# Altium schematic sheet 数控电源.SCHDOC
size 254 x 165 mm; SheetNumber: 0; SheetTotal: 0
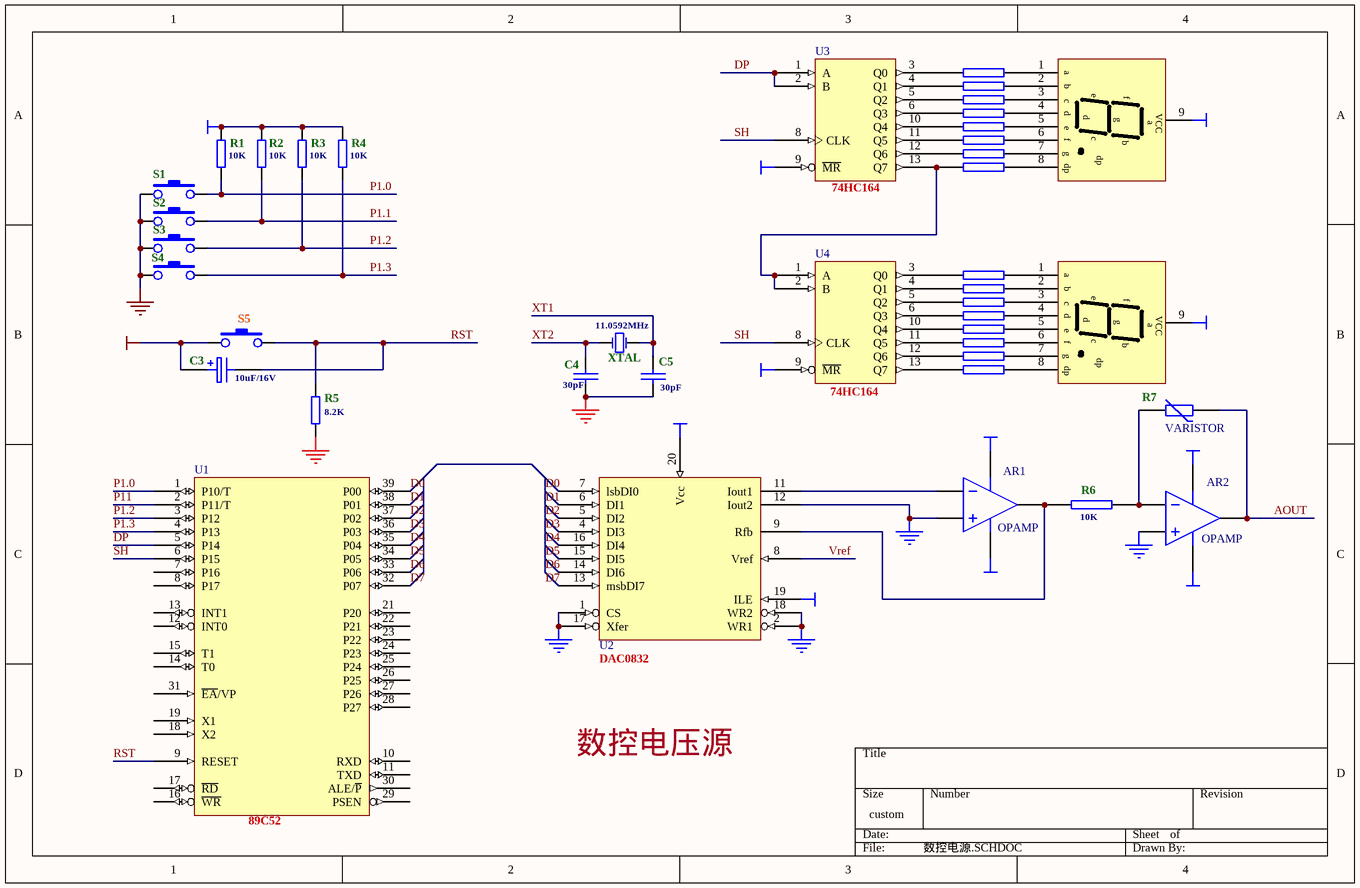
[diagram p0: 数控电源.SCHDOC]

## Parts
(Parts that share a designator on the sheet are numbered #1, #2 ... from top to bottom, then left to right.)
11.0592MHz  XTAL  [BCY-W2/D3.1]
?#1  (no value)
?#2  (no value)
AR1  OPAMP
AR2  OPAMP
C3  10uF/16V  [e100]
C4  30pF  [C0805]
C5  30pF  [C0805]
R1  10K  [r0805]
R2  10K  [r0805]
R3  10K  [r0805]
R4  10K  [r0805]
R5#1  (no value)
R5#2  (no value)
R5#3  8.2K  [r0805]
R6#1  (no value)
R6#2  (no value)
R6#3  10K
R7#1  (no value)
R7#2  (no value)
R7#3  VARISTOR
R8#1  (no value)
R8#2  (no value)
R9#1  (no value)
R9#2  (no value)
R10#1  (no value)
R10#2  (no value)
R11#1  (no value)
R11#2  (no value)
R12#1  (no value)
R12#2  (no value)
S1  KEY1  [KEY-1]  (value not drawn)
S2  KEY1  [KEY-1]  (value not drawn)
S3  KEY1  [KEY-1]  (value not drawn)
S4  KEY1  [KEY-1]  (value not drawn)
S5  KEY1  [KEY-1]  (value not drawn)
U1  89C52  [DIP40]
U2  DAC0832  [DIP-20]
U3  74HC164  [DIP-14]
U4  74HC164  [DIP-14]

## Nets
+5: AR1.2(IN+) U2.1(CS) U2.2(WR1) U2.12(Iout2) U2.17(Xfer) U2.18(WR2) U2.20(Vcc)
+12: AR1.4(V+) AR2.4(V+)
-12: AR1.5(V-) AR2.5(V-)
GND: AR2.2(IN+) C4.1 C5.1 R5#3.1 S1.2 S2.2 S3.2 S4.2 U1.20(GND) U2.3(GND) U2.10(GND) U3.7(GND) U4.7(GND)
VCC: ?#1.9(VCC) ?#2.9(VCC) C3.1 R1.2 R2.2 R3.1 R4.1 S5.1 U1.40(VCC) U2.19(ILE) U3.9(~{MR}) U3.14(VCC) U4.9(~{MR}) U4.14(VCC)
AOUT: AR2.3(OUT) R7#3.2
D0: U1.39(P00)
D1: U1.38(P01)
D2: U1.37(P02)
D3: U1.36(P03)
D4: U1.35(P04)
D5: U1.34(P05)
D6: U1.33(P06)
D7: U1.32(P07)
DP: U1.5(P14) U3.1(A) U3.2(B)
P1.0: R1.1 S1.1 U1.1(P10/T)
P1.1: R2.1 S2.1
P1.2: R3.2 S3.1 U1.3(P12)
P1.3: R4.2 S4.1 U1.4(P13)
P11: U1.2(P11/T)
RST: C3.2 R5#3.2 S5.2 U1.9(RESET)
SH: U1.6(P15) U3.8(CLK) U4.8(CLK)
Vref: U2.8(Vref)
XT1: 11.0592MHz.1(OSC1) C5.2
XT2: 11.0592MHz.2(OSC2) C4.2
Net?#1_1: ?#1.1(a) R10#1.2
Net?#1_2: ?#1.2(b) R8#1.2
Net?#1_3: ?#1.3(c) R11#1.2
Net?#1_4: ?#1.4(d) R9#1.2
Net?#1_5: ?#1.5(e) R6#1.2
Net?#1_6: ?#1.6(f) R7#1.2
Net?#1_7: ?#1.7(g) R12#1.2
Net?#1_8: ?#1.8(dp) R5#1.2
Net?#2_1: ?#2.1(a) R10#2.2
Net?#2_2: ?#2.2(b) R8#2.2
Net?#2_3: ?#2.3(c) R11#2.2
Net?#2_4: ?#2.4(d) R9#2.2
Net?#2_5: ?#2.5(e) R6#2.2
Net?#2_6: ?#2.6(f) R7#2.2
Net?#2_7: ?#2.7(g) R12#2.2
Net?#2_8: ?#2.8(dp) R5#2.2
NetAR1_1: AR1.1(IN-) U2.11(Iout1)
NetAR1_3: AR1.3(OUT) R6#3.2 U2.9(Rfb)
NetAR2_1: AR2.1(IN-) R6#3.1 R7#3.1
NetR5#1_1: R5#1.1 U3.13(Q7) U4.1(A) U4.2(B)
NetR5#2_1: R5#2.1 U4.13(Q7)
NetR6#1_1: R6#1.1 U3.10(Q4)
NetR6#2_1: R6#2.1 U4.10(Q4)
NetR7#1_1: R7#1.1 U3.11(Q5)
NetR7#2_1: R7#2.1 U4.11(Q5)
NetR8#1_1: R8#1.1 U3.4(Q1)
NetR8#2_1: R8#2.1 U4.4(Q1)
NetR9#1_1: R9#1.1 U3.6(Q3)
NetR9#2_1: R9#2.1 U4.6(Q3)
NetR10#1_1: R10#1.1 U3.3(Q0)
NetR10#2_1: R10#2.1 U4.3(Q0)
NetR11#1_1: R11#1.1 U3.5(Q2)
NetR11#2_1: R11#2.1 U4.5(Q2)
NetR12#1_1: R12#1.1 U3.12(Q6)
NetR12#2_1: R12#2.1 U4.12(Q6)

Not connected (* = marked no-connect by the designer): U1 7(P16) 8(P17) 10(RXD) 11(TXD) 12(INT0) 13(INT1) 14(T0) 15(T1) 16(~{WR}) 17(~{RD}) 18(X2) 19(X1) 21(P20) 22(P21) 23(P22) 24(P23) 25(P24) 26(P25) 27(P26) 28(P27) 29(PSEN) 30(ALE/~{P}) 31(~{EA}/VP); U2 4(DI3) 5(DI2) 6(DI1) 7(lsbDI0) 13(msbDI7) 14(DI6) 15(DI5) 16(DI4)

## Buses and harness runs
bus D0 = D1 = D2 = D3 = D4 = D5 = D6

## Notes on the sheet
- 数控电压源
- Labels drawn without touching a wire or pin: D7

## Library data of the parts
11.0592MHz = XTAL: Crystal Oscillator; Manufacturer: Generic Components; Published: 08/06/2000; Publisher: Altium Hobart Technology Centre; Class: Oscillator; SubClass: Crystal Oscillator
?#1 ?#2 = AMBERCA: Common Anode Seven-Segment Display, Right Hand Decimal
AR1 AR2 = OPAMP: Operational Amplifier
C3 = ELECTRO1: Electrolytic Capacitor
C4 C5 = CAP: Capacitor
R1-R4 R5#3 = RES1
R5#1 R5#2 R6#1-R6#3 R7#1 R7#2 R8#1 R8#2 R9#1 R9#2 R10#1 R10#2 R11#1 R11#2 R12#1 R12#2 = RES2
U1 = 8032AH
U2 = DAC0830